# EAGLE design ledmatrixv2 (EAGLE 7.2.0)
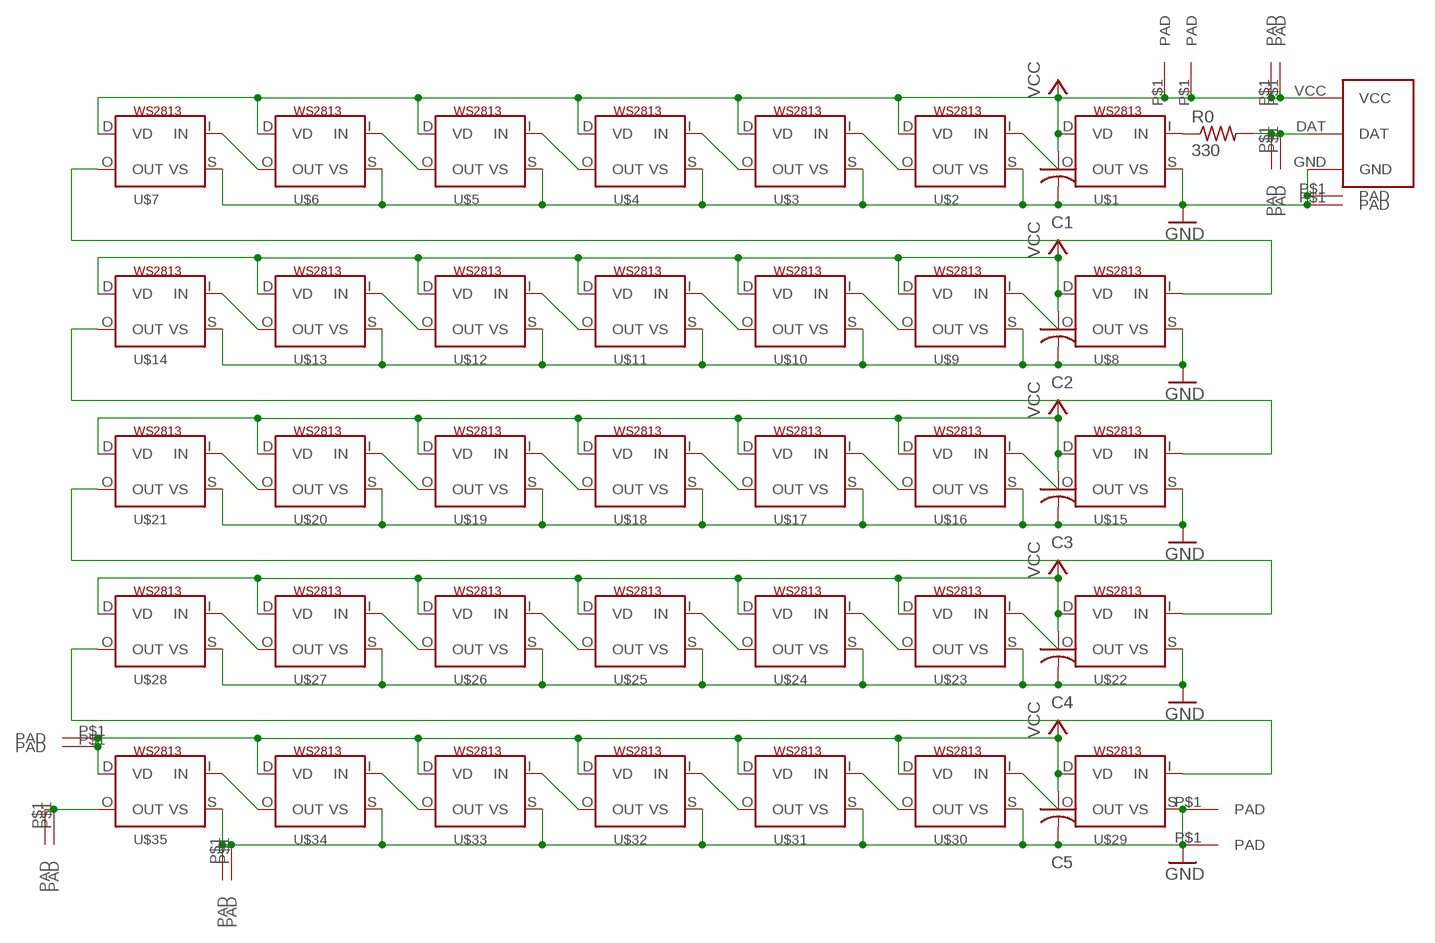
[diagram p0: schematic, sheet 1]

## Parts
C1  C-USC0603K  [C0603K]
C2  C-USC0603K  [C0603K]
C3  C-USC0603K  [C0603K]
C4  C-USC0603K  [C0603K]
C5  C-USC0603K  [C0603K]
R0  330  R-US_R0603  [R0603]
U$1  WS2813  [RGBLED5050_4]
U$2  WS2813  [RGBLED5050_4]
U$3  WS2813  [RGBLED5050_4]
U$4  WS2813  [RGBLED5050_4]
U$5  WS2813  [RGBLED5050_4]
U$6  WS2813  [RGBLED5050_4]
U$7  WS2813  [RGBLED5050_4]
U$8  WS2813  [RGBLED5050_4]
U$9  WS2813  [RGBLED5050_4]
U$10  WS2813  [RGBLED5050_4]
U$11  WS2813  [RGBLED5050_4]
U$12  WS2813  [RGBLED5050_4]
U$13  WS2813  [RGBLED5050_4]
U$14  WS2813  [RGBLED5050_4]
U$15  WS2813  [RGBLED5050_4]
U$16  WS2813  [RGBLED5050_4]
U$17  WS2813  [RGBLED5050_4]
U$18  WS2813  [RGBLED5050_4]
U$19  WS2813  [RGBLED5050_4]
U$20  WS2813  [RGBLED5050_4]
U$21  WS2813  [RGBLED5050_4]
U$22  WS2813  [RGBLED5050_4]
U$23  WS2813  [RGBLED5050_4]
U$24  WS2813  [RGBLED5050_4]
U$25  WS2813  [RGBLED5050_4]
U$26  WS2813  [RGBLED5050_4]
U$27  WS2813  [RGBLED5050_4]
U$28  WS2813  [RGBLED5050_4]
U$29  WS2813  [RGBLED5050_4]
U$30  WS2813  [RGBLED5050_4]
U$31  WS2813  [RGBLED5050_4]
U$32  WS2813  [RGBLED5050_4]
U$33  WS2813  [RGBLED5050_4]
U$34  WS2813  [RGBLED5050_4]
U$35  WS2813  [RGBLED5050_4]
U$36  SQWMINI-MATRIX  [SQWMINI-MATRIX]
U$37  TESTPAD  [TESTPAD]
U$38  TESTPAD  [TESTPAD]
U$39  TESTPAD  [TESTPAD]
U$40  TESTPAD  [TESTPAD]
U$41  TESTPAD  [TESTPAD]
U$42  TESTPAD  [TESTPAD]
U$43  TESTPAD  [TESTPAD]
U$44  TESTPAD  [TESTPAD]
U$45  TESTPAD  [TESTPAD]
U$46  TESTPAD  [TESTPAD]
U$47  TESTPAD  [TESTPAD]
U$48  TESTPAD  [TESTPAD]
U$49  TESTPAD  [TESTPAD]
U$50  TESTPAD  [TESTPAD]
U$51  TESTPAD  [TESTPAD]
U$52  TESTPAD  [TESTPAD]

## Nets
DATIN: R0.2 U$36.DAT U$41.P$1(PAD) U$42.P$1(PAD)
DATOUT: U$35.O(OUT) U$47.P$1(PAD) U$48.P$1(PAD)
GND: C1.2 C2.2 C3.2 C4.2 C5.2 U$1.S(VS) U$2.S(VS) U$3.S(VS) U$4.S(VS) U$5.S(VS) U$6.S(VS) U$7.S(VS) U$8.S(VS) U$9.S(VS) U$10.S(VS) U$11.S(VS) U$12.S(VS) U$13.S(VS) U$14.S(VS) U$15.S(VS) U$16.S(VS) U$17.S(VS) U$18.S(VS) U$19.S(VS) U$20.S(VS) U$21.S(VS) U$22.S(VS) U$23.S(VS) U$24.S(VS) U$25.S(VS) U$26.S(VS) U$27.S(VS) U$28.S(VS) U$29.S(VS) U$30.S(VS) U$31.S(VS) U$32.S(VS) U$33.S(VS) U$34.S(VS) U$35.S(VS) U$36.GND U$39.P$1(PAD) U$40.P$1(PAD) U$45.P$1(PAD) U$46.P$1(PAD) U$50.P$1(PAD) U$52.P$1(PAD)
N$1: U$2.O(OUT) U$3.I(IN)
N$2: U$1.O(OUT) U$2.I(IN)
N$3: U$4.O(OUT) U$5.I(IN)
N$4: U$22.O(OUT) U$23.I(IN)
N$5: U$6.O(OUT) U$7.I(IN)
N$6: U$3.O(OUT) U$4.I(IN)
N$7: U$8.O(OUT) U$9.I(IN)
N$8: U$7.O(OUT) U$8.I(IN)
N$9: U$5.O(OUT) U$6.I(IN)
N$10: U$9.O(OUT) U$10.I(IN)
N$11: U$10.O(OUT) U$11.I(IN)
N$12: U$11.O(OUT) U$12.I(IN)
N$13: U$13.O(OUT) U$14.I(IN)
N$14: U$12.O(OUT) U$13.I(IN)
N$15: U$15.O(OUT) U$16.I(IN)
N$16: U$14.O(OUT) U$15.I(IN)
N$17: U$16.O(OUT) U$17.I(IN)
N$18: U$17.O(OUT) U$18.I(IN)
N$19: U$18.O(OUT) U$19.I(IN)
N$20: U$20.O(OUT) U$21.I(IN)
N$21: U$19.O(OUT) U$20.I(IN)
N$22: U$23.O(OUT) U$24.I(IN)
N$23: R0.1 U$1.I(IN)
N$24: U$24.O(OUT) U$25.I(IN)
N$25: U$25.O(OUT) U$26.I(IN)
N$26: U$27.O(OUT) U$28.I(IN)
N$27: U$26.O(OUT) U$27.I(IN)
N$28: U$21.O(OUT) U$22.I(IN)
N$29: U$29.O(OUT) U$30.I(IN)
N$30: U$30.O(OUT) U$31.I(IN)
N$31: U$31.O(OUT) U$32.I(IN)
N$32: U$32.O(OUT) U$33.I(IN)
N$33: U$34.O(OUT) U$35.I(IN)
N$34: U$33.O(OUT) U$34.I(IN)
N$35: U$28.O(OUT) U$29.I(IN)
VCC: C1.1 C2.1 C3.1 C4.1 C5.1 U$1.D(VD) U$2.D(VD) U$3.D(VD) U$4.D(VD) U$5.D(VD) U$6.D(VD) U$7.D(VD) U$8.D(VD) U$9.D(VD) U$10.D(VD) U$11.D(VD) U$12.D(VD) U$13.D(VD) U$14.D(VD) U$15.D(VD) U$16.D(VD) U$17.D(VD) U$18.D(VD) U$19.D(VD) U$20.D(VD) U$21.D(VD) U$22.D(VD) U$23.D(VD) U$24.D(VD) U$25.D(VD) U$26.D(VD) U$27.D(VD) U$28.D(VD) U$29.D(VD) U$30.D(VD) U$31.D(VD) U$32.D(VD) U$33.D(VD) U$34.D(VD) U$35.D(VD) U$36.VCC U$37.P$1(PAD) U$38.P$1(PAD) U$43.P$1(PAD) U$44.P$1(PAD) U$49.P$1(PAD) U$51.P$1(PAD)

## Library data of the parts
C1-C5 = adafruit2013:C-US: CAPACITOR, American symbol
R0 = adafruitGood:R-US_: RESISTOR, American symbol
U$1-U$35 = adafruit:WS2813
U$36 = LilyPad-Wearables:SQWMINI-MATRIX
U$37-U$52 = LilyPad-Wearables:TESTPAD

## Net classes
0 default: width 0.203 mm, clearance 0.203 mm

## Board
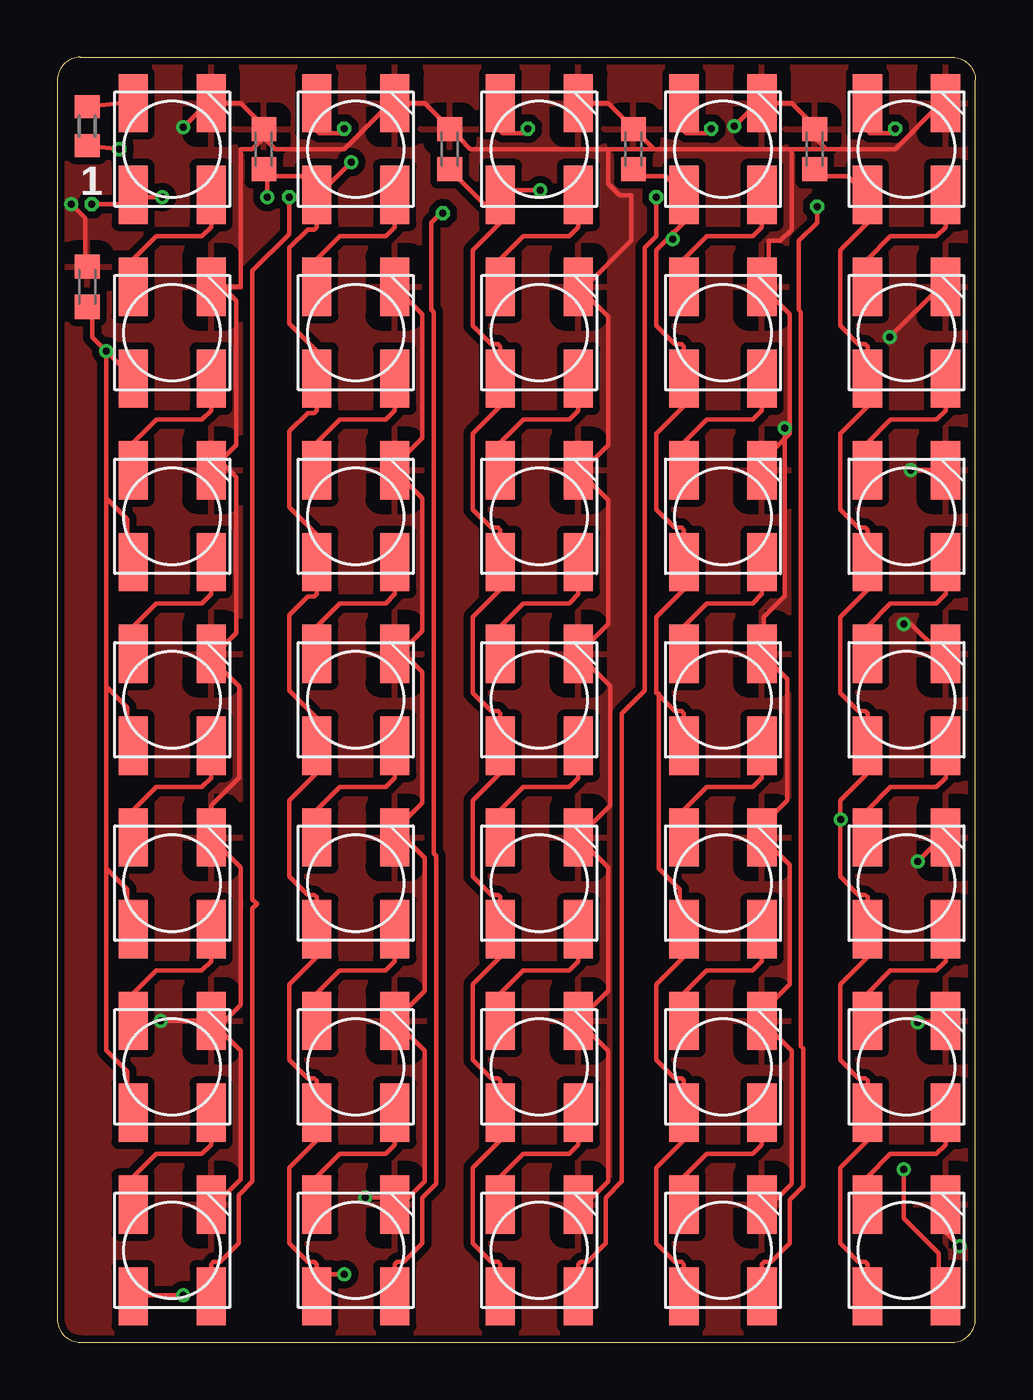
[diagram p1: board, top side]
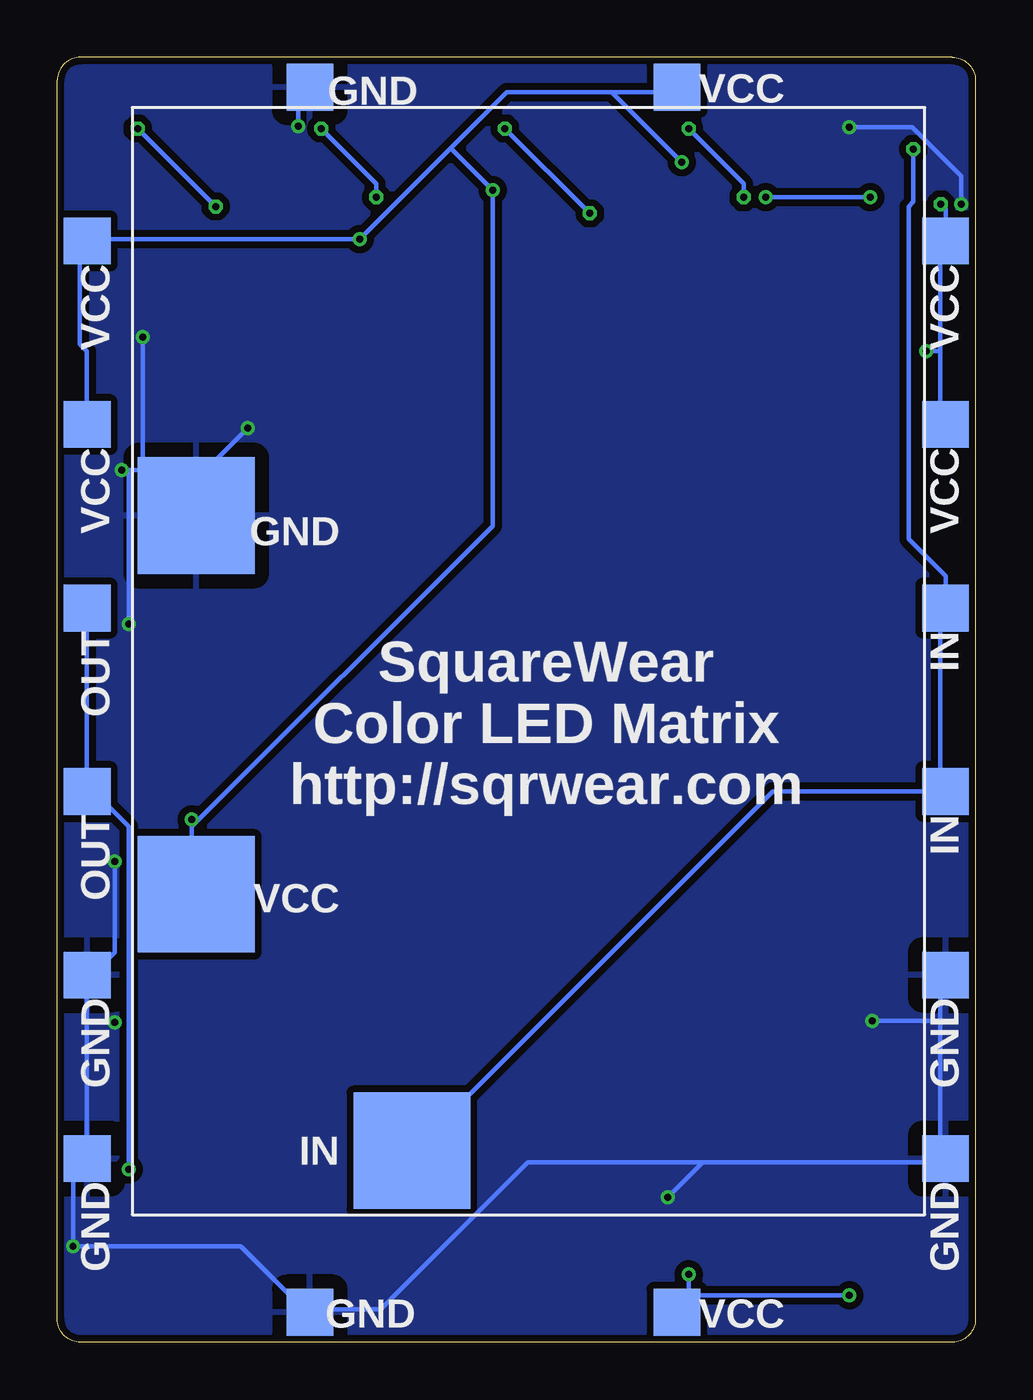
[diagram p2: board, bottom side, seen from below]

Size 40 x 56 mm. Coordinates in mm from the lower left corner, seen from the top.
Outline: 0,55 0,1 arc90 1,0 39,0 arc90 40,1 40,55 arc90 39,56 1,56 arc90 0,55
Copper layers (1*16): Top 0.035mm / dielectric 1.5mm / Bottom 0.035mm
Design rules "Fusion_eagle_rule_v1.1 *": minimum track width 6mil, minimum drill 12mil, track to track 6mil, track to pad 6mil, pad to pad 6mil, via to via 6mil, smd to smd 0mil, copper to edge 10mil, drill to drill 10mil, minimum pad ring 10mil, minimum via ring 6mil, stop-mask expansion 2mil, vias tented up to drill 100mil, thermal gap 25mil
vRestrict: area 37.8,43.5 to 39,46.8; area 37.8,35.4 to 39,38.7; area 37.8,27.5 to 39,30.8; area 37.8,19.4 to 39,22.7; area 37.8,11.5 to 39,14.8; area 37.7,3.5 to 38.9,6.8; area 27.7,34.8 to 31,36; area 27.6,18.7 to 30.9,19.9; area 27.1,7.7 to 30.4,8.9; area 0.8,43.5 to 2,46.8; area 0.8,35.5 to 2,38.8; area 0.8,27.6 to 2,30.9; 3 more areas

### Footprints (pad centres in the part's own frame; a part is rotated, then mirrored left to right if it is on the bottom)
C0603K = smd 1.05 x 1.08: 1 -0.875,0; 2 0.875,0
R0603 = smd 1 x 1.1: 1 -0.85,0; 2 0.85,0
RGBLED5050_4 = smd 2.54 x 1.27: D -2,1.7; I 2,1.7; O -2,-1.7; S 2,-1.7
SQWMINI-MATRIX = smd 5.08 x 5.08: DAT 22.352,41.656; GND 31.75,13.97; VCC 31.75,30.48
TESTPAD = smd 2.032 x 2.032: P$1 0,0

### Placement (x,y rotation side)
C1  1.3,46 90 top
C2  9,52 90 top
C3  17.1,52 90 top
C4  25.1,52 90 top
C5  33,52 90 top
R0  1.3,53 270 top
U$1  5,52 90 top
U$2  5,44 90 top
U$3  5,36 90 top
U$4  5,28 90 top
U$5  5,20 90 top
U$6  5,12 90 top
U$7  5,4 90 top
U$8  13,52 90 top
U$9  13,44 90 top
U$10  13,36 90 top
U$11  13,28 90 top
U$12  13,20 90 top
U$13  13,12 90 top
U$14  13,4 90 top
U$15  21,52 90 top
U$16  21,44 90 top
U$17  21,36 90 top
U$18  21,28 90 top
U$19  21,20 90 top
U$20  21,12 90 top
U$21  21,4 90 top
U$22  29,52 90 top
U$23  29,44 90 top
U$24  29,36 90 top
U$25  29,28 90 top
U$26  29,20 90 top
U$27  29,12 90 top
U$28  29,4 90 top
U$29  37,52 90 top
U$30  37,44 90 top
U$31  37,36 90 top
U$32  37,28 90 top
U$33  37,20 90 top
U$34  37,12 90 top
U$35  37,4 90 top
U$36  2.2,50 180 bottom
U$37  1.3,48 0 bottom
U$38  1.3,40 0 bottom
U$39  1.3,16 0 bottom
U$40  1.3,8 0 bottom
U$41  1.3,32 0 bottom
U$42  1.3,24 0 bottom
U$43  38.7,48 0 bottom
U$44  38.7,40 0 bottom
U$45  38.7,16 0 bottom
U$46  38.7,8 0 bottom
U$47  38.7,32 0 bottom
U$48  38.7,24 0 bottom
U$49  13,1.3 0 bottom
U$50  29,1.3 0 bottom
U$51  13,54.7 0 bottom
U$52  29,54.7 0 bottom

### Tracks (layer width: path | path; a pad name or v marks a point on that pad's centre or on a via)
DATIN  (via drill 0.3)
  Top 0.203: v2.7,52 R0.2
  Bottom 0.203: v2.7,52 2.7,49.7 2.9,49.5 2.9,35 1.3,33.4 U$41.P$1 1.52,31.92 1.52,24.3 U$42.P$1 1.52,24 8.84,24 24.38,8.45 U$36.DAT
DATOUT  (via drill 0.3)
  Top 0.203: v36.88,7.54 36.88,5.4 38.41,3.88 38.41,2.05 U$35.O
  Bottom 0.203: U$47.P$1 38.71,31.92 38.71,24.3 U$48.P$1 38.41,24 36.88,22.47 v36.88,7.54
GND  (via drill 0.3)
  Top 0.203: 7.2,46 7.8,45.4 7.8,39.1 7.1,38.4 | 7.1,38.4 U$3.S | 7.1,38.4 7.8,37.7 7.8,30.9 6.9,30 U$4.S 6.71,29.79 7.92,28.57 7.92,24.61 6.71,23.39 6.71,22.17 U$5.S 8,20.7 8,14.7 7.3,14 U$6.S | U$7.S 6.9,6 8,7.1 8,12.7 U$6.S | U$21.S 23,6 24,7 24,12.7 U$20.S 24,15.3 24,20.7 U$19.S 24.1,23.4 24.1,28.6 U$18.S 24,31.3 24,36.7 U$17.S 22.9,38 24,39.1 24,44.7 U$16.S 23,46 25,48 25,50 24.5,50 24,50.5 24,52 | U$9.S 15.9,44.8 15.9,39.4 14.7,38.2 U$10.S 15.9,36.8 15.9,31 14.9,30 U$11.S 14.4,30.3 14.4,30.7 15.9,29.2 15.9,23.5 14.7,22.3 U$12.S 14.2,22.5 14.2,22.9 16,21.1 16,15.3 U$13.S 16,12.7 16,7 15,6 U$14.S 15.24,6.32 v13.41,6.32 | U$24.S 30.7,38.4 31.77,39.47 | 31.77,39.47 31.9,39.6 31.9,44.8 U$23.S 31,46 31,48 31.5,48 32,48.5 32,52 | U$27.S 30.7,14.4 31.9,15.6 31.9,20.8 U$26.S 30.7,22.5 31.8,23.6 31.8,28.9 U$25.S 30.79,30.09 30.79,31.62 31.7,32.53 31.7,39.54 | U$28.S 31.1,6 32,6.9 32,12.7 U$27.S | 30.3,14.4 U$27.S | v0.61,49.6 1.22,48.99 1.22,47.16 C1.2 | v5.49,52.95 6.4,53.87 U$1.S 8,54 9,53 C2.2 9,52.5 | v36.27,43.81 38.41,45.94 U$30.S | v37.19,38.02 38.41,38.02 U$31.S | v36.88,31.31 37.19,31.31 38.41,30.09 U$32.S | v37.49,20.95 38.41,21.86 U$33.S | v37.49,13.94 38.41,13.94 U$34.S | v39.32,4.18 38.71,4.79 38.71,5.71 U$35.S | 31.7,39.54 v31.7,39.85 | 31.7,39.54 31.77,39.47 | 9,52.5 9.5,52 12.5,52 14.5,54 U$8.S 16,54 17,53 C3.2 17.5,52.5 18,52 24,52 | U$15.S 24,54 25,53 C4.2 25.5,52.5 26,52 | v29.5,53 30.5,54 U$22.S 32,54 33,53 C5.2 33,52.5 33.5,52 | 33.5,52 36.5,52 38.5,54 U$29.S | 33.5,52 32,52 | 32,52 26,52 | 26,52 24,52 | 9,52.5 8.5,52 8,52 8,46 7.2,46 | 7.2,46 U$2.S | v4.5,14 U$6.S
  Bottom 0.203: 1.52,14 1.52,8.15 U$40.P$1 1.52,7.84 11.89,7.84 | 1.52,14 1.52,15.77 U$39.P$1 | 11.89,7.84 19.51,7.84 25.91,1.44 28.96,1.44 U$50.P$1 29.26,1.44 32,4.18 v39.32,4.18 39.32,7.23 38.71,7.84 U$46.P$1 38.71,8.15 38.71,13.94 | v0.61,49.6 0.61,50.82 2.74,52.95 v5.49,52.95 | v13.41,6.32 11.89,7.84 | v36.27,43.81 36.27,38.32 35.97,38.02 | 34.75,36.8 34.14,36.19 U$36.GND | 34.75,36.8 35.97,38.02 | 35.97,38.02 36.88,38.02 | 36.88,38.02 v37.19,38.02 | 35.97,38.02 U$36.GND | 36.88,38.02 v36.88,31.31 | 38.71,13.94 38.71,15.77 U$45.P$1 38.41,16.07 37.49,16.99 v37.49,20.95 | 38.71,13.94 v37.49,13.94 | v31.7,39.85 34.75,36.8 | 34.75,36.8 U$36.GND | v29.5,53 29.5,54 29,54.5 U$52.P$1 | 1.52,14 v4.5,14 | 1.5,14 1.52,14
  pour Top (isolate 0.305): 40,56 40,0 0,0 0,56
  pour Bottom (isolate 0.305): 40,56 40,0 0,0 0,56
N$1
  Top 0.203: U$3.I 3.3,39.2 4.3,40.2 6.3,40.2 6.7,40.6 U$2.O
N$2
  Top 0.203: U$2.I 3.3,47.2 4.3,48.2 6.3,48.2 6.7,48.6 U$1.O
N$3
  Top 0.203: U$5.I 3.3,23.2 4.3,24.2 6.3,24.2 6.7,24.6 U$4.O
N$4
  Top 0.203: U$23.I 27.3,47.2 28.3,48.2 30.3,48.2 30.7,48.6 U$22.O
N$5
  Top 0.203: U$7.I 3.3,7.2 4.3,8.2 6.3,8.2 6.7,8.6 U$6.O
N$6
  Top 0.203: U$4.I 3.3,31.2 4.3,32.2 6.3,32.2 6.7,32.6 U$3.O
N$7
  Top 0.203: U$9.I 11.3,47.2 12.3,48.2 14.3,48.2 14.7,48.6 U$8.O
N$8  (via drill 0.3)
  Top 0.203: U$7.O 6.7,3.4 6.8,3.5 7.1,3.5 7.9,4.3 7.9,6.4 8.5,7 8.5,18.9 8.7,19.1 8.5,19.3 8.5,46.7 10.1,48.3 v10.1,49.9 | v12.5,52.9 12.3,52.7 11.4,52.7 11.3,52.8 U$8.I
  Bottom 0.203: v10.1,49.9 10.1,50.5 v12.5,52.9
N$9
  Top 0.203: U$6.I 3.3,15.2 4.3,16.2 6.3,16.2 6.7,16.6 U$5.O
N$10
  Top 0.203: U$10.I 11.3,39.2 12.3,40.2 14.3,40.2 14.7,40.6 U$9.O
N$11
  Top 0.203: U$11.I 11.3,31.2 12.3,32.2 14.3,32.2 14.7,32.6 U$10.O
N$12
  Top 0.203: U$12.I 11.3,23.2 12.3,24.2 14.3,24.2 14.7,24.6 U$11.O
N$13
  Top 0.203: U$14.I 11.3,7.2 12.3,8.2 14.3,8.2 14.7,8.6 U$13.O
N$14
  Top 0.203: U$13.I 11.3,15.2 12.3,16.2 14.3,16.2 14.7,16.6 U$12.O
N$15
  Top 0.203: U$16.I 19.3,47.2 20.3,48.2 22.3,48.2 22.7,48.6 U$15.O
N$16  (via drill 0.3)
  Top 0.203: U$14.O 14.7,3.4 14.8,3.5 15.1,3.5 15.9,4.3 15.9,6.3 16.5,6.9 16.5,21.2 16.4,21.3 16.4,44.9 16.3,45 16.3,48.8 16.7,49.2 v16.8,49.2 | v20.5,52.9 20.3,52.7 19.4,52.7 19.3,52.8 U$15.I
  Bottom 0.203: v20.5,52.9 v16.8,49.2
N$17
  Top 0.203: U$17.I 19.3,39.2 20.3,40.2 22.3,40.2 22.7,40.6 U$16.O
N$18
  Top 0.203: U$18.I 19.3,31.2 20.3,32.2 22.3,32.2 22.7,32.6 U$17.O
N$19
  Top 0.203: U$19.I 19.3,23.2 20.3,24.2 22.3,24.2 22.7,24.6 U$18.O
N$20
  Top 0.203: U$21.I 19.3,7.2 20.3,8.2 22.3,8.2 22.7,8.6 U$20.O
N$21
  Top 0.203: U$20.I 19.3,15.2 20.3,16.2 22.3,16.2 22.7,16.6 U$19.O
N$22
  Top 0.203: U$24.I 27.3,39.2 28.3,40.2 30.3,40.2 30.7,40.6 U$23.O
N$23
  Top 0.203: U$1.I 3.3,54.4 3.1,54.4 2.7,54 R0.1
N$24
  Top 0.203: U$25.I 27.3,31.2 28.3,32.2 30.3,32.2 30.7,32.6 U$24.O
N$25
  Top 0.203: U$26.I 27.3,23.2 28.3,24.2 30.3,24.2 30.7,24.6 U$25.O
N$26
  Top 0.203: U$28.I 27.3,7.2 28.3,8.2 30.3,8.2 30.7,8.6 U$27.O
N$27
  Top 0.203: U$27.I 27.3,15.2 28.3,16.2 30.3,16.2 30.7,16.6 U$26.O
N$28  (via drill 0.3)
  Top 0.203: U$21.O 22.7,3.4 22.8,3.5 23.1,3.5 23.9,4.3 23.9,6.3 24.6,7 24.6,27.4 25.6,28.4 25.6,47.7 26.1,48.2 v26.1,49.9 | v28.5,52.9 28.3,52.7 27.4,52.7 27.3,52.8 U$22.I
  Bottom 0.203: v26.1,49.9 26.1,50.5 v28.5,52.9
N$29
  Top 0.203: U$30.I 35.3,47.2 36.3,48.2 38.3,48.2 38.7,48.6 U$29.O
N$30
  Top 0.203: U$31.I 35.3,39.2 36.3,40.2 38.3,40.2 38.7,40.6 U$30.O
N$31
  Top 0.203: U$32.I 35.3,31.2 36.3,32.2 38.3,32.2 38.7,32.6 U$31.O
N$32
  Top 0.203: U$33.I 35.3,23.2 36.3,24.2 38.3,24.2 38.7,24.6 U$32.O
N$33
  Top 0.203: U$35.I 35.3,7.2 36.3,8.2 38.3,8.2 38.7,8.6 U$34.O
N$34
  Top 0.203: U$34.I 35.3,15.2 36.3,16.2 38.3,16.2 38.7,16.6 U$33.O
N$35  (via drill 0.3)
  Top 0.203: U$28.O 30.7,3.4 30.8,3.5 31.1,3.5 31.9,4.3 31.9,6.2 32.5,6.8 32.5,12.8 32.4,12.9 32.4,44.9 32.3,45 32.3,48 33.1,48.8 v33.1,49.5 | v36.5,52.9 36.3,52.7 35.4,52.7 35.3,52.8 U$29.I
  Bottom 0.203: v36.5,52.9 v33.1,49.5
VCC  (via drill 0.3)
  Top 0.203: v1.5,49.6 3.3,49.6 U$1.D 3.35,49.9 v4.57,49.9 | U$8.D 11.3,48.6 11.2,48.5 10.9,48.5 10.1,47.7 10.1,44.4 11.3,43.2 U$9.D 11.3,40.6 11.2,40.5 10.9,40.5 10.1,39.7 10.1,36.4 11.3,35.2 U$10.D 11.3,32.6 11.2,32.5 10.9,32.5 10.1,31.7 10.1,28.4 11.3,27.2 U$11.D 11.3,24.8 10.1,23.6 10.1,20.3 10.9,19.5 11.2,19.5 11.3,19.4 U$12.D 11.3,16.8 10.1,15.6 10.1,12.3 10.9,11.5 11.2,11.5 11.3,11.4 U$13.D 11.3,8.8 10.1,7.6 10.1,4.3 10.9,3.5 11.2,3.5 11.3,3.4 U$14.D 11.28,2.96 v12.5,2.96 | U$15.D 19.3,48.8 18.1,47.6 18.1,44.3 18.9,43.5 19.2,43.5 19.3,43.4 U$16.D 19.3,40.8 18.1,39.6 18.1,36.3 18.9,35.5 19.2,35.5 19.3,35.4 U$17.D 19.3,32.8 18.1,31.6 18.1,28.3 18.9,27.5 19.2,27.5 19.3,27.4 U$18.D 19.3,24.8 18.1,23.6 18.1,20.3 18.9,19.5 19.2,19.5 19.3,19.4 U$19.D 19.3,16.8 18.1,15.6 18.1,12.3 18.9,11.5 19.2,11.5 19.3,11.4 U$20.D 19.3,8.8 18.1,7.6 18.1,4.3 18.9,3.5 19.2,3.5 19.3,3.4 U$21.D | 26.85,48.35 26.1,47.6 26.1,44.3 26.9,43.5 27.2,43.5 27.3,43.4 U$23.D 27.3,40.8 26.1,39.6 26.1,36.3 26.9,35.5 27.2,35.5 27.3,35.4 U$24.D 27.3,32.8 26.1,31.6 26.1,28.3 26.18,28.23 | 26.85,48.35 27.3,48.8 U$22.D 27.13,50.21 26.52,50.82 25.3,50.82 C4.1 | 26.18,28.23 26.9,27.5 27.2,27.5 27.3,27.4 U$25.D | U$28.D 27.3,3.4 27.2,3.5 26.9,3.5 26.1,4.3 26.1,7.6 27.3,8.8 U$27.D 27.3,11.4 27.2,11.5 26.9,11.5 26.1,12.3 26.1,15.6 27.3,16.8 U$26.D 27.13,18.2 27.13,19.73 26.21,20.64 26.21,28.26 26.18,28.23 | 34.1,22.78 34.1,20.3 34.9,19.5 35.2,19.5 35.3,19.4 U$33.D 35.3,16.8 34.1,15.6 34.1,12.3 34.9,11.5 35.2,11.5 35.3,11.4 U$34.D 35.3,8.8 34.1,7.6 34.1,4.3 34.9,3.5 35.2,3.5 35.3,3.4 U$35.D
  Top 0.203: 34.1,22.78 34.1,23.6 35.3,24.8 U$32.D 35.3,27.4 35.2,27.5 34.9,27.5 34.1,28.3 34.1,31.6 35.3,32.8 U$31.D 35.3,35.4 35.2,35.5 34.9,35.5 34.1,36.3 34.1,39.6 35.3,40.8 U$30.D 35.3,43.4 35.2,43.5 34.9,43.5 34.1,44.3 34.1,47.6 35.3,48.8 U$29.D 35.05,50.21 34.44,50.82 33.22,50.82 C5.1 | 9.14,50.82 10.67,50.82 11.28,50.21 U$8.D | v5.49,2.05 3.35,2.05 U$7.D | C3.1 17.37,50.82 19.2,48.99 U$15.D | v21.03,50.21 19.51,50.21 U$15.D | v34.14,22.78 34.1,22.78 | v12.8,51.43 11.58,50.21 U$8.D | v26.82,48.08 26.82,48.38 26.85,48.35 | v2.13,43.2 3.05,42.28 U$2.D | v2.13,43.2 1.52,43.81 1.52,44.72 C1.1 | 2.13,36.8 3.05,35.88 3.05,34.05 U$3.D | v2.13,43.2 2.13,36.8 | 2.13,28.57 3.05,27.65 3.05,26.13 U$4.D | 2.13,36.8 2.13,28.57 | 2.13,20.64 3.05,19.73 3.05,18.2 U$5.D | 2.13,28.57 2.13,20.64 | 2.13,20.64 2.13,12.72 3.05,11.8 3.05,10.28 U$6.D | v9.14,49.9 9.14,50.82 | 9.14,50.82 C2.1
  Bottom 0.203: v1.5,49.6 1.3,49.4 U$37.P$1 1.52,47.77 1.52,43.2 | 12.5,2.05 12.5,1.75 12.8,1.44 U$49.P$1 12.5,2.05 | 12.5,2.05 v12.5,2.96 | 12.5,2.05 v5.49,2.05 | 15.85,54.48 20.42,54.48 22.86,52.04 | 15.85,54.48 13.11,54.48 U$51.P$1 | 22.86,52.04 v26.82,48.08 38.41,48.08 U$43.P$1 38.71,47.77 39.01,47.47 39.01,43.5 38.71,43.2 38.71,40.15 U$44.P$1 | 22.86,52.04 v21.03,50.21 21.03,35.58 34.14,22.47 | 34.14,22.47 34.14,19.73 U$36.VCC | 34.14,22.47 v34.14,22.78 | 15.85,54.48 v12.8,51.43 | 1.52,43.2 1.52,40.15 U$38.P$1 | v2.13,43.2 1.52,43.2 | v4.57,49.9 v9.14,49.9

### Text on the board
tNames: 1
bNames: VCC | GND | VCC | VCC | VCC | VCC | GND | IN | OUT | SquareWear / Color LED Matrix / http://sqrwear.com | IN | OUT | VCC | GND | GND | IN | GND | GND | VCC | GND